# Altium schematic sheet 1_Power.SchDoc
size A; SheetNumber: 1; SheetTotal: 3
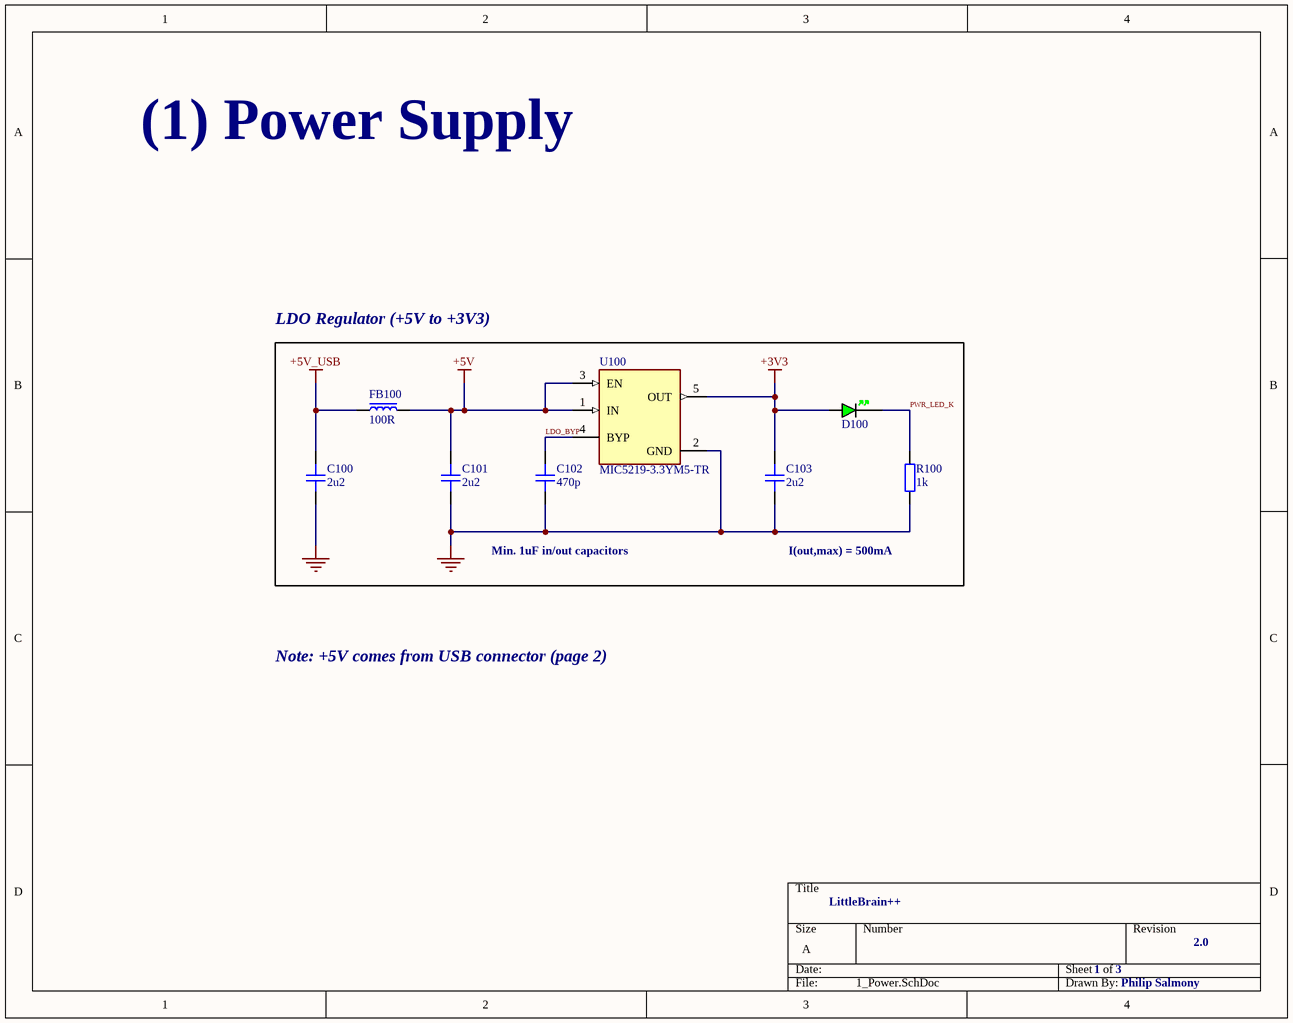
[diagram p0: 1_Power.SchDoc]

## Parts
C100  2u2  [CAP_0603]
C101  2u2  [CAP_0603]
C102  470p  [CAP_0402]
C103  2u2  [CAP_0603]
D100  GREEN  [LED_0402_GREEN]  (value not drawn)
FB100  100R  [FB_0603]
R100  1k  [RES_0402]
U100  MIC5219-3.3YM5-TR  [FP-SOT23-5LD-PL-1-IPC_A]

## Nets
+3V3: C103.2 D100.A U100.5(OUT)
+5V: C101.2 FB100.2 U100.1(IN) U100.3(EN)
+5V_USB: C100.2 FB100.1
GND: C100.1 C101.1 C102.1 C103.1 R100.1 U100.2(GND)
LDO_BYP: C102.2 U100.4(BYP)
PWR_LED_K: D100.K R100.2

## Notes on the sheet
- (1) Power Supply
- LDO Regulator (+5V to +3V3)
- Min. 1uF in/out capacitors
- I(out,max) = 500mA
- Note: +5V comes from USB connector (page 2)
- LittleBrain++
- 1
- 3
- 2.0
- Philip Salmony

## Library data of the parts
C100 C101 C103 = CAP_0603_16V: Capacitor SMD 0603 16V
C102 = CAP_0402_16V: Capacitor SMD 0402 16V
D100 = LED_0402_GREEN: LED 0402 GREEN SMD
FB100 = FB_0603: Ferrite Bead SMD 0603
R100 = RES_0402: Resistor SMD 0402
U100 = CMP-06324-000027-1: IC REG LINEAR 3.3V 500MA SOT23-5; Dropout Voltage: 350mV; Output Type: Fixed; Number of Regulators: 1; Max Input Voltage: 12V; Min Input Voltage: 2.5V; Min Operating Temperature: -40°C; Nominal Output Voltage: 3.3V; Output Voltage: 3.3V; Packaging: Cut Tape; Mount: Surface Mount; Number of Pins: 5; Case/Package: SOT-23-5; Lead Free: Lead Free; Max Operating Temperature: 125°C; REACH SVHC: No SVHC; Output Current: 500mA